# Altium schematic sheet PowerSwitch_DS2_DS3_DS4.SchDoc
size A3; SheetNumber: 1; SheetTotal: 4
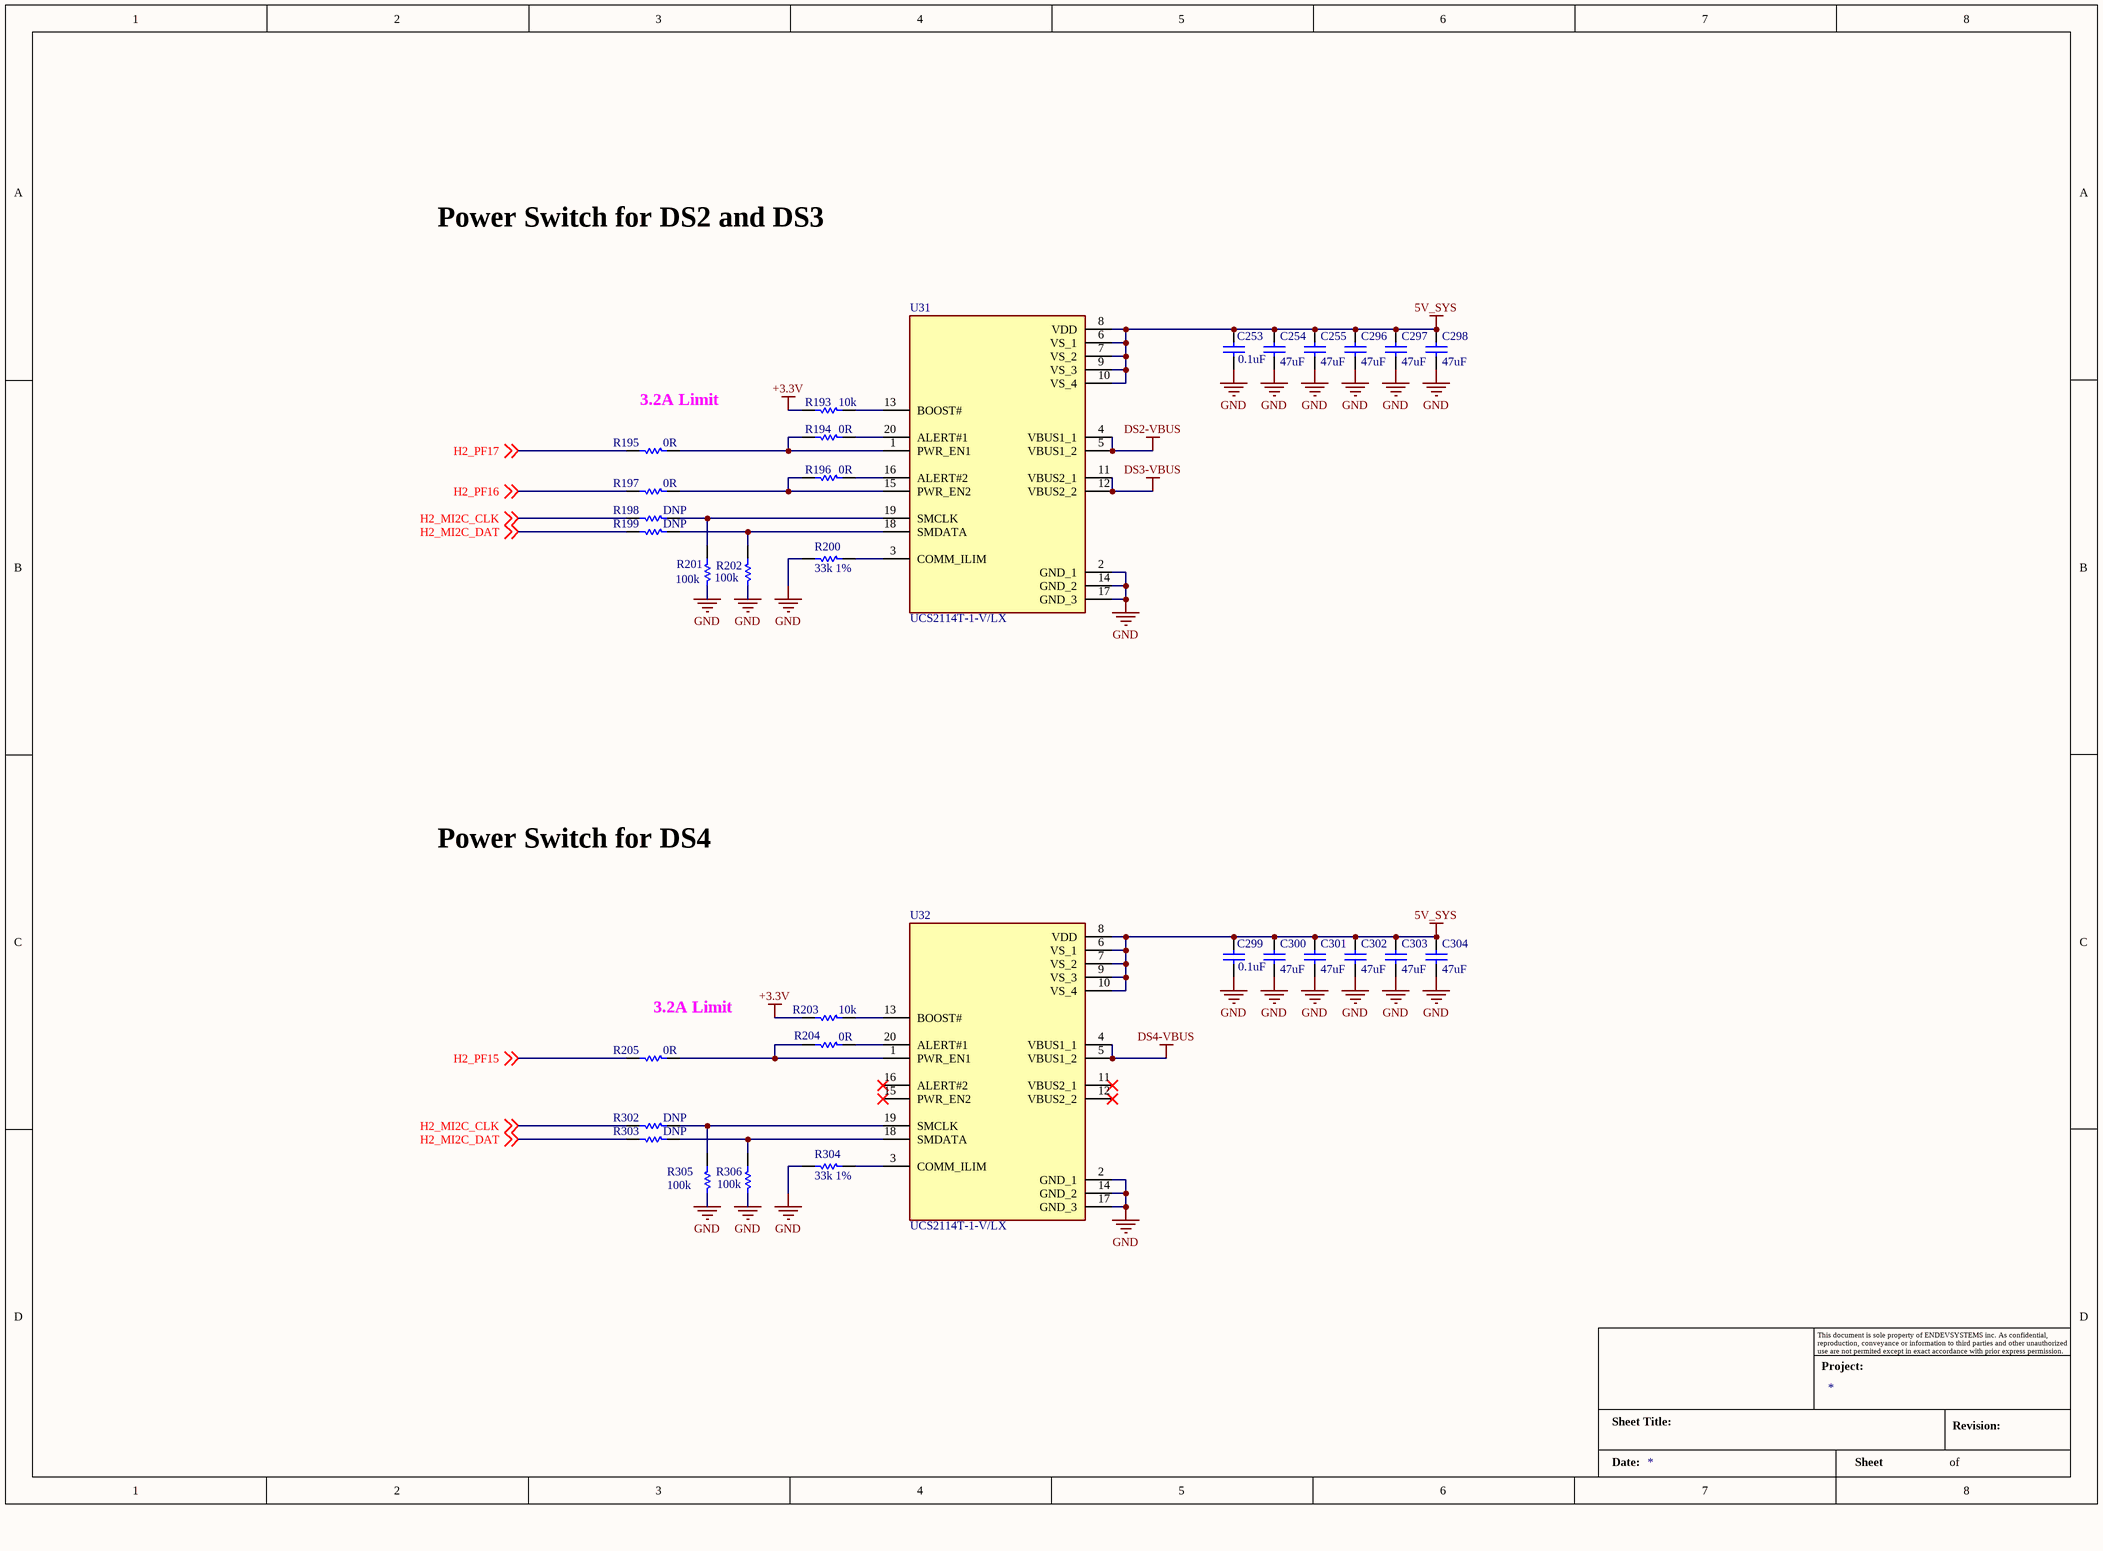
[diagram p0: PowerSwitch_DS2_DS3_DS4.SchDoc]

## Parts
?  Title_Block  (value not drawn)  (graphical)
C253  0.1uF  [C-0402/1005]
C254  value 47uF  [C-0402/1005]  (hidden comment: 0.1uF)
C255  value 47uF  [C-0402/1005]  (hidden comment: 0.1uF)
C296  value 47uF  [C-0402/1005]  (hidden comment: 0.1uF)
C297  value 47uF  [C-0402/1005]  (hidden comment: 0.1uF)
C298  value 47uF  [C-0402/1005]  (hidden comment: 0.1uF)
C299  0.1uF  [C-0402/1005]
C300  value 47uF  [C-0402/1005]  (hidden comment: 0.1uF)
C301  value 47uF  [C-0402/1005]  (hidden comment: 0.1uF)
C302  value 47uF  [C-0402/1005]  (hidden comment: 0.1uF)
C303  value 47uF  [C-0402/1005]  (hidden comment: 0.1uF)
C304  value 47uF  [C-0402/1005]  (hidden comment: 0.1uF)
R193  10k  [R-0402/1005]
R194  0R  [R-0402/1005]
R195  0R  [R-0402/1005]
R196  0R  [R-0402/1005]
R197  0R  [R-0402/1005]
R198  DNP  [R-0402/1005]
R199  DNP  [R-0402/1005]
R200  33k 1%  [R-0402/1005]
R201  100k  [R-0402/1005]
R202  100k  [R-0402/1005]
R203  10k  [R-0402/1005]
R204  0R  [R-0402/1005]
R205  0R  [R-0402/1005]
R302  DNP  [R-0402/1005]
R303  DNP  [R-0402/1005]
R304  33k 1%  [R-0402/1005]
R305  100k  [R-0402/1005]
R306  100k  [R-0402/1005]
U31  UCS2114T-1-V/LX  [QFN50P300X300X90-20N-D]
U32  UCS2114T-1-V/LX  [QFN50P300X300X90-20N-D]

## Nets
5V_SYS: C253.2 C254.2 C255.2 C296.2 C297.2 C298.2 C299.2 C300.2 C301.2 C302.2 C303.2 C304.2 U31.6(VS_1) U31.7(VS_2) U31.8(VDD) U31.9(VS_3) U31.10(VS_4) U32.6(VS_1) U32.7(VS_2) U32.8(VDD) U32.9(VS_3) U32.10(VS_4)
+3.3V: R193.1 R203.1
DS2-VBUS: U31.4(VBUS1_1) U31.5(VBUS1_2)
DS3-VBUS: U31.11(VBUS2_1) U31.12(VBUS2_2)
DS4-VBUS: U32.4(VBUS1_1) U32.5(VBUS1_2)
GND: C253.1 C254.1 C255.1 C296.1 C297.1 C298.1 C299.1 C300.1 C301.1 C302.1 C303.1 C304.1 R200.1 R201.1 R202.1 R304.1 R305.1 R306.1 U31.2(GND_1) U31.14(GND_2) U31.17(GND_3) U32.2(GND_1) U32.14(GND_2) U32.17(GND_3)
H2_MI2C_CLK: R198.1 R302.1 ; off-sheet H2_MI2C_CLK
H2_MI2C_DAT: R199.1 R303.1 ; off-sheet H2_MI2C_DAT
H2_PF15: R205.1 ; off-sheet H2_PF15
H2_PF16: R197.1 ; off-sheet H2_PF16
H2_PF17: R195.1 ; off-sheet H2_PF17
NetR193_2: R193.2 U31.13(BOOST#)
NetR194_1: R194.1 R195.2 U31.1(PWR_EN1)
NetR194_2: R194.2 U31.20(ALERT#1)
NetR196_1: R196.1 R197.2 U31.15(PWR_EN2)
NetR196_2: R196.2 U31.16(ALERT#2)
NetR198_2: R198.2 R201.2 U31.19(SMCLK)
NetR199_2: R199.2 R202.2 U31.18(SMDATA)
NetR200_2: R200.2 U31.3(COMM_ILIM)
NetR203_2: R203.2 U32.13(BOOST#)
NetR204_1: R204.1 R205.2 U32.1(PWR_EN1)
NetR204_2: R204.2 U32.20(ALERT#1)
NetR302_2: R302.2 R305.2 U32.19(SMCLK)
NetR303_2: R303.2 R306.2 U32.18(SMDATA)
NetR304_2: R304.2 U32.3(COMM_ILIM)

Not connected (* = marked no-connect by the designer): U32 11(VBUS2_1)* 12(VBUS2_2)* 15(PWR_EN2)* 16(ALERT#2)*

## Notes on the sheet
- Power Switch for DS2 and DS3
- (near R195) 3.2A Limit
- Power Switch for DS4
- (near R205) 3.2A Limit
- (in symbol Title_Block) This document is sole property of ENDEVSYSTEMS inc. As confidential, reproduction, conveyance or information to third parties and other unauthorized use are not permited except in exact accordance with prior express permission.; Project:; Sheet Title:; Revision:; Date:; Sheet; of

## Library data of the parts
C253-C255 C296-C304 = Cap: Capacitor; Published: 8-Jun-2000; LatestRevisionDate: 17-Jul-2002; LatestRevisionNote: Re-released for DXP Platform.; PackageReference: RAD-0.3; Publisher: Altium Limited; PackageDescription: Radial Cap, Thru-Hole; 2 Leads; 0.3 in Pin Spacing
  C253 C299: Value: 0.1uF
R193 R203 = Res1: Resistor; Published: 8-Jun-2000; LatestRevisionDate: 17-Jul-2002; LatestRevisionNote: Re-released for DXP Platform.; PackageReference: AXIAL-0.3; Publisher: Altium Limited; PackageDescription: Axial Device, Thru-Hole; 2 Leads; 0.3 in Pin Spacing; Value: 10K
R194-R202 R204 R205 R302-R306 = Res1: Resistor; Value: 10K; Published: 8-Jun-2000; LatestRevisionDate: 17-Jul-2002; LatestRevisionNote: Re-released for DXP Platform.; PackageReference: AXIAL-0.3; Publisher: Altium Limited; PackageDescription: Axial Device, Thru-Hole; 2 Leads; 0.3 in Pin Spacing
U31 U32 = UCS2114T-1-V_LX: Integrated Circuit; Manufacturer_Name: Microchip; Datasheet Link: https://www.mouser.in/datasheet/2/268/UCS2114_Data_Sheet_20005743B-2900672.pdf; Height: 0.9mm; Manufacturer_Part_Number: UCS2114T-1-V/LX; Mouser Part Number: 579-UCS2114T-1-V/LX; Mouser Price/Stock: https://www.mouser.co.uk/ProductDetail/Microchip-Technology/UCS2114T-1-V-LX?qs=Mv7BduZupUg9QQFwmxWMcA%3D%3D; Arrow Part Number: UCS2114T-1-V/LX; Arrow Price/Stock: https://www.arrow.com/en/products/ucs2114t-1-vlx/microchip-technology?region=nac
? = Title_Block: Date:: *; Project:: *